# EAGLE design cpu (EAGLE 4.16)
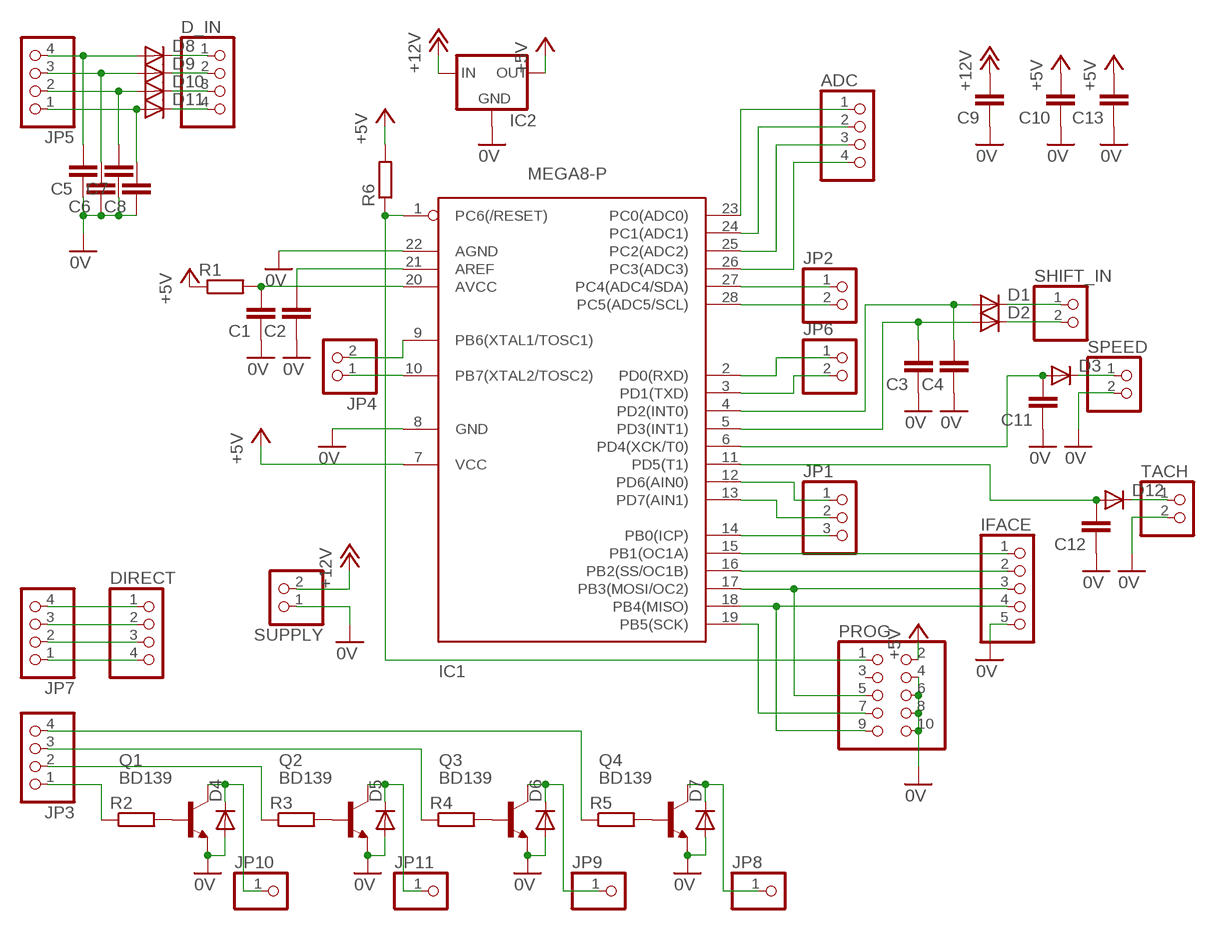
[diagram p0: schematic, sheet 1]

## Parts
ADC  PINHD-1X4  [1X04]
C1  C-EU050-025X075  [C050-025X075]
C2  C-EU050-025X075  [C050-025X075]
C3  C-EU050-025X075  [C050-025X075]
C4  C-EU050-025X075  [C050-025X075]
C5  C-EU050-025X075  [C050-025X075]
C6  C-EU050-025X075  [C050-025X075]
C7  C-EU050-025X075  [C050-025X075]
C8  C-EU050-025X075  [C050-025X075]
C9  C-EU050-025X075  [C050-025X075]
C10  C-EU050-025X075  [C050-025X075]
C11  C-EU050-025X075  [C050-025X075]
C12  C-EU050-025X075  [C050-025X075]
C13  C-EU050-025X075  [C050-025X075]
D1  DIODE-D-5  [D-5]
D2  DIODE-D-5  [D-5]
D3  DIODE-D-5  [D-5]
D4  DIODE-D-5  [D-5]
D5  DIODE-D-5  [D-5]
D6  DIODE-D-5  [D-5]
D7  DIODE-D-5  [D-5]
D8  DIODE-D-5  [D-5]
D9  DIODE-D-5  [D-5]
D10  DIODE-D-5  [D-5]
D11  DIODE-D-5  [D-5]
D12  DIODE-D-5  [D-5]
D_IN  PINHD-1X4  [1X04]
DIRECT  PINHD-1X4  [1X04]
IC1  MEGA8-P  [DIL28-3]
IC2  78XXL  [78XXL]
IFACE  PINHD-1X5  [1X05]
JP1  PINHD-1X3  [1X03]
JP2  PINHD-1X2  [1X02]
JP3  PINHD-1X4  [1X04]
JP4  PINHD-1X2  [1X02]
JP5  PINHD-1X4  [1X04]
JP6  PINHD-1X2  [1X02]
JP7  PINHD-1X4  [1X04]
JP8  PINHD-1X1  [1X01]
JP9  PINHD-1X1  [1X01]
JP10  PINHD-1X1  [1X01]
JP11  PINHD-1X1  [1X01]
PROG  PINHD-2X5  [2X05]
Q1  BD139  [TO126]
Q2  BD139  [TO126]
Q3  BD139  [TO126]
Q4  BD139  [TO126]
R1  R-EU_0207/7  [0207/7]
R2  R-EU_0207/7  [0207/7]
R3  R-EU_0207/7  [0207/7]
R4  R-EU_0207/7  [0207/7]
R5  R-EU_0207/7  [0207/7]
R6  R-EU_0207/7  [0207/7]
SHIFT_IN  PINHD-1X2  [1X02]
SPEED  PINHD-1X2  [1X02]
SUPPLY  PINHD-1X2  [1X02]
TACH  PINHD-1X2  [1X02]

## Nets
0V: C1.1 C2.1 C3.1 C4.1 C5.1 C6.1 C7.1 C8.1 C9.1 C10.1 C11.1 C12.1 C13.1 D4.A D5.A D6.A D7.A IC1.8(GND) IC1.22(AGND) IC2.GND IFACE.5 PROG.4 PROG.6 PROG.8 PROG.10 Q1.1(E) Q2.1(E) Q3.1(E) Q4.1(E) SPEED.2 SUPPLY.1 TACH.2
+5V: C10.2 C13.2 IC1.7(VCC) IC2.OUT PROG.2 R1.1 R6.2
+12V: C9.2 IC2.IN SUPPLY.2
N$1: D7.C JP8.1 Q4.2(C)
N$2: IC1.17(PB3(MOSI/OC2)) IFACE.3 PROG.5
N$3: IC1.18(PB4(MISO)) IFACE.4 PROG.9
N$4: IC1.19(PB5(SCK)) PROG.7
N$5: IC1.1(PC6(/RESET)) PROG.1 R6.1
N$6: C4.2 D1.A IC1.4(PD2(INT0))
N$7: C3.2 D2.A IC1.5(PD3(INT1))
N$8: C1.2 IC1.20(AVCC) R1.2
N$9: C2.2 IC1.21(AREF)
N$10: C12.2 D12.A IC1.11(PD5(T1))
N$11: C11.2 D3.A IC1.6(PD4(XCK/T0))
N$12: Q1.3(B) R2.2
N$13: Q2.3(B) R3.2
N$14: D4.C JP10.1 Q1.2(C)
N$15: D5.C JP11.1 Q2.2(C)
N$16: JP3.1 R2.1
N$17: Q3.3(B) R4.2
N$18: D6.C JP9.1 Q3.2(C)
N$19: JP3.2 R3.1
N$20: Q4.3(B) R5.2
N$21: JP3.3 R4.1
N$22: JP3.4 R5.1
N$23: D1.C SHIFT_IN.1
N$24: D2.C SHIFT_IN.2
N$25: ADC.1 IC1.23(PC0(ADC0))
N$26: ADC.2 IC1.24(PC1(ADC1))
N$27: ADC.3 IC1.25(PC2(ADC2))
N$28: ADC.4 IC1.26(PC3(ADC3))
N$29: IC1.27(PC4(ADC4/SDA)) JP2.1
N$30: IC1.28(PC5(ADC5/SCL)) JP2.2
N$31: IC1.13(PD7(AIN1)) JP1.2
N$32: IC1.12(PD6(AIN0)) JP1.1
N$33: IC1.15(PB1(OC1A)) IFACE.1
N$34: IC1.16(PB2(SS/OC1B)) IFACE.2
N$35: D8.C D_IN.1
N$36: D9.C D_IN.2
N$37: D10.C D_IN.3
N$38: D11.C D_IN.4
N$39: C5.2 D8.A JP5.4
N$40: C6.2 D9.A JP5.3
N$41: C7.2 D10.A JP5.2
N$42: C8.2 D11.A JP5.1
N$43: IC1.14(PB0(ICP)) JP1.3
N$44: IC1.2(PD0(RXD)) JP6.1
N$45: IC1.3(PD1(TXD)) JP6.2
N$46: IC1.10(PB7(XTAL2/TOSC2)) JP4.1
N$47: IC1.9(PB6(XTAL1/TOSC1)) JP4.2
N$48: DIRECT.4 JP7.1
N$49: DIRECT.3 JP7.2
N$50: DIRECT.2 JP7.3
N$51: DIRECT.1 JP7.4
N$52: D3.C SPEED.1
N$54: D12.C TACH.1
Unconnected: PROG.3

## Library data of the parts
ADC D_IN DIRECT JP3 JP5 JP7 = pinhead:PINHD-1X4: PIN HEADER
C1-C13 = rcl:C-EU: CAPACITOR, European symbol
D1-D12 = diode:DIODE-: DIODE
IC1 = atmel:MEGA8-P: MICROCONTROLLER 8 Kbytes FLASH 1 kbytes SRAM 512 bytes EEPROM USART 4-channel 10 bit ADC 2-channel 8 bit ADC Source: avr.lbr
IC2 = v-reg:78XXL: VOLTAGE REGULATOR
IFACE = pinhead:PINHD-1X5: PIN HEADER
JP1 = pinhead:PINHD-1X3: PIN HEADER
JP2 JP4 JP6 SHIFT_IN SPEED SUPPLY TACH = pinhead:PINHD-1X2: PIN HEADER
JP8-JP11 = pinhead:PINHD-1X1: PIN HEADER
PROG = pinhead:PINHD-2X5: PIN HEADER
Q1-Q4 = transistor-npn:BD139*: NPN Transistor
R1-R6 = rcl:R-EU_: RESISTOR, European symbol

## Board
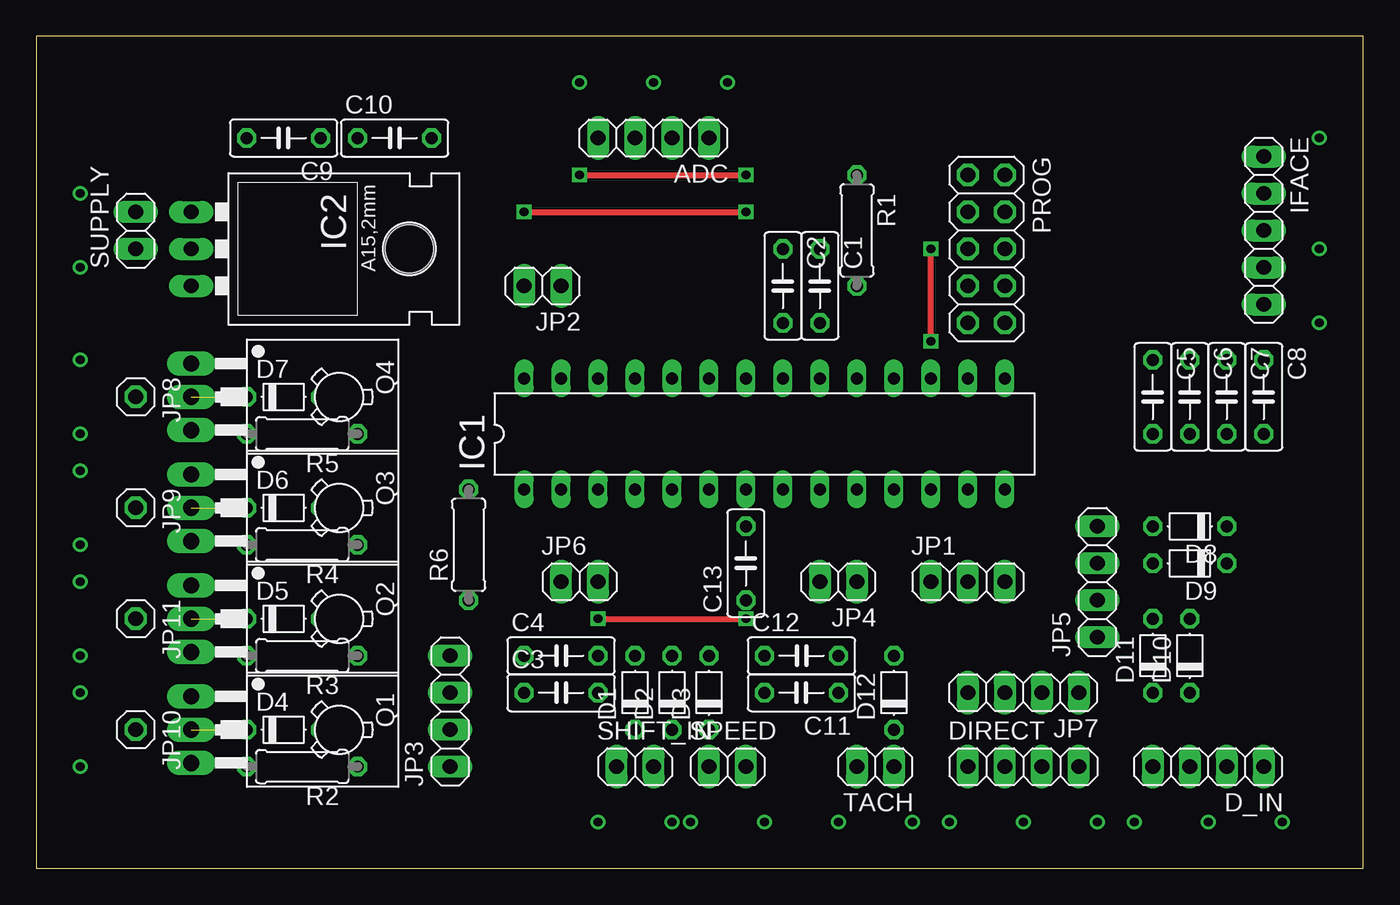
[diagram p1: board, top side]
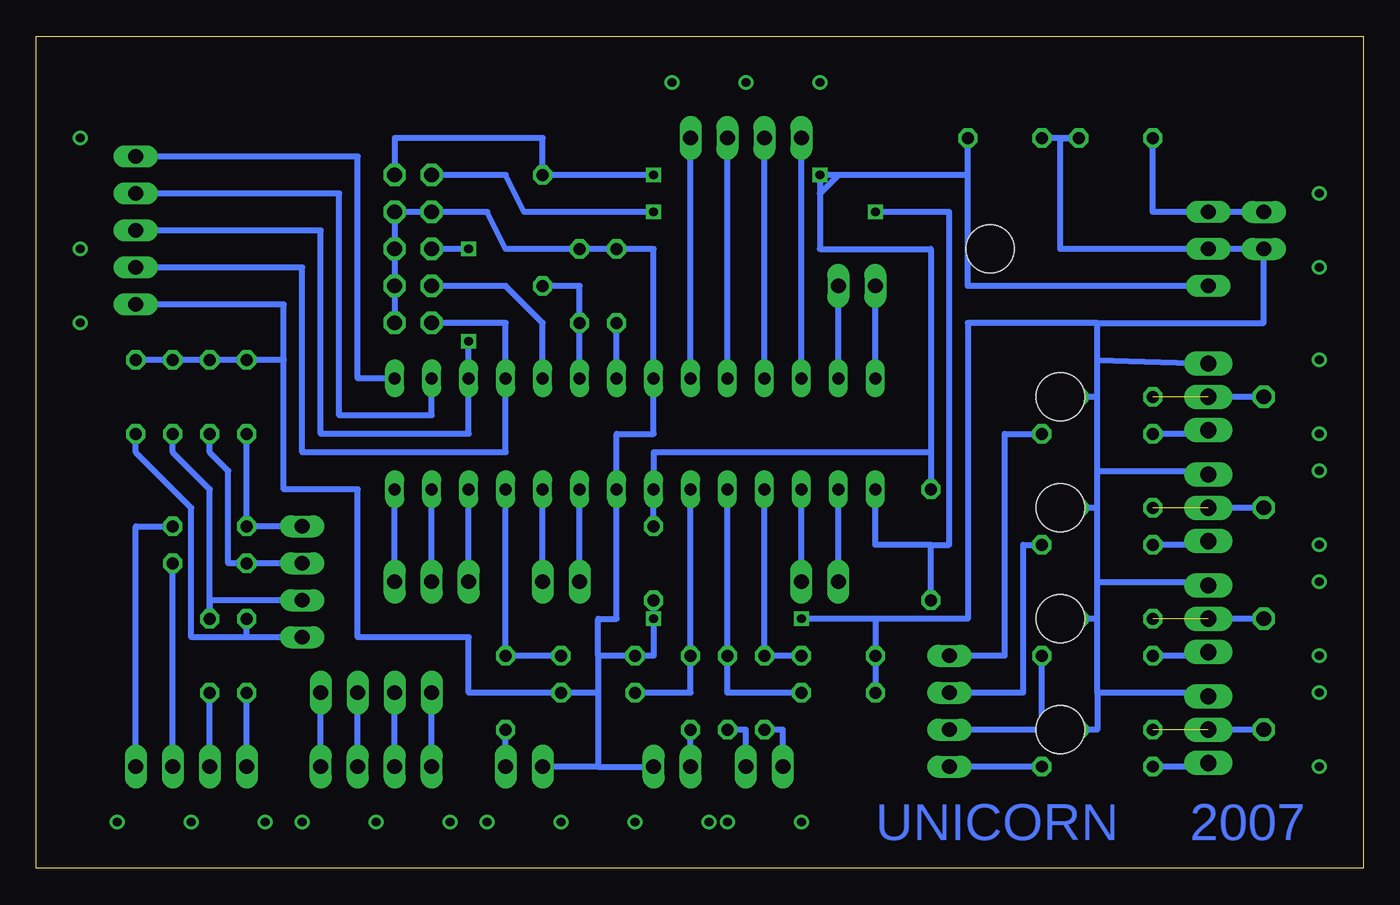
[diagram p2: board, bottom side, seen from below]

Size 91.11 x 57.14 mm. Coordinates in mm from the lower left corner, seen from the top.
Outline: 0,0 91.11,0 91.11,57.14 0,57.14 0,0
Copper layers (1*16): Top 0.035mm / dielectric 1.5mm / Bottom 0.035mm
Design rules "default": minimum track width 10mil, minimum drill 24mil, track to track 8mil, track to pad 8mil, pad to pad 8mil, via to via 8mil, smd to smd 8mil, copper to edge 40mil, drill to drill 8mil, minimum pad ring 10mil, minimum via ring 8mil, stop-mask expansion 4mil, vias tented up to drill 0mil, thermal gap 10mil

### Footprints (pad centres in the part's own frame; a part is rotated, then mirrored left to right if it is on the bottom)
1X04 = drill 1.016 long: 1 -3.81,0; 2 -1.27,0; 3 1.27,0; 4 3.81,0
C050-025X075 = drill 0.813 octagon: 1 -2.54,0; 2 2.54,0
D-5 = drill 0.813 octagon: A 2.54,0; C -2.54,0
DIL28-3 = drill 0.813 long: 1 -16.51,-3.81; 2 -13.97,-3.81; 3 -11.43,-3.81; 4 -8.89,-3.81; 5 -6.35,-3.81; 6 -3.81,-3.81; 7 -1.27,-3.81; 8 1.27,-3.81; 9 3.81,-3.81; 10 6.35,-3.81; 11 8.89,-3.81; 12 11.43,-3.81; 13 13.97,-3.81; 14 16.51,-3.81; 15 16.51,3.81; 16 13.97,3.81; 17 11.43,3.81; 18 8.89,3.81; 19 6.35,3.81; 20 3.81,3.81; 21 1.27,3.81; 22 -1.27,3.81; 23 -3.81,3.81; 24 -6.35,3.81; 25 -8.89,3.81; 26 -11.43,3.81; 27 -13.97,3.81; 28 -16.51,3.81
78XXL = drill 1.016 long: GND 0,-3.81; IN -2.54,-3.81; OUT 2.54,-3.81 | hole 3.302: 0,11.176
1X05 = drill 1.016 long: 1 -5.08,0; 2 -2.54,0; 3 0,0; 4 2.54,0; 5 5.08,0
1X03 = drill 1.016 long: 1 -2.54,0; 2 0,0; 3 2.54,0
1X02 = drill 1.016 long: 1 -1.27,0; 2 1.27,0
1X01 = drill 1.016 octagon: 1 0,0
2X05 = drill 1.016 octagon: 1 -5.08,-1.27; 2 -5.08,1.27; 3 -2.54,-1.27; 4 -2.54,1.27; 5 0,-1.27; 6 0,1.27; 7 2.54,-1.27; 8 2.54,1.27; 9 5.08,-1.27; 10 5.08,1.27
TO126 = drill 1.118 long: 1 -2.286,-5.08; 2 0,-5.08; 3 2.286,-5.08 | hole 3.302: 0,5.08
0207/7 = drill 0.813 octagon: 1 -3.81,0; 2 3.81,0

### Placement (x,y rotation side)
ADC  42.38,50.16 180 top
C1  53.81,40 270 top
C2  51.27,40 270 top
C3  36.03,12.06 0 top
C4  36.03,14.6 0 top
C5  76.67,32.38 270 top
C6  79.21,32.38 270 top
C7  81.75,32.38 270 top
C8  84.29,32.38 270 top
C9  16.98,50.16 180 top
C10  24.6,50.16 0 top
C11  52.54,12.06 180 top
C12  52.54,14.6 0 top
C13  48.73,20.95 90 top
D1  41.11,12.06 90 top
D2  43.65,12.06 90 top
D3  46.19,12.06 90 top
D4  16.98,9.52 0 top
D5  16.98,17.14 0 top
D6  16.98,24.76 0 top
D7  16.98,32.38 0 top
D8  79.21,23.49 180 top
D9  79.21,20.95 180 top
D10  79.21,14.6 90 top
D11  76.67,14.6 90 top
D12  58.89,12.06 90 top
D_IN  80.48,6.98 180 top
DIRECT  67.78,6.98 0 top
IC1  50,29.84 0 top
IC2  14.44,42.54 270 top
IFACE  84.29,43.81 270 top
JP1  63.97,19.68 0 top
JP2  34.76,40 180 top
JP3  28.41,10.79 90 top
JP4  55.08,19.68 180 top
JP5  72.86,19.68 90 top
JP6  37.3,19.68 0 top
JP7  67.78,12.06 180 top
JP8  6.82,32.38 270 top
JP9  6.82,24.76 270 top
JP10  6.82,9.52 270 top
JP11  6.82,17.14 270 top
PROG  65.24,42.54 270 top
Q1  15.71,9.52 270 top
Q2  15.71,17.14 270 top
Q3  15.71,24.76 270 top
Q4  15.71,32.38 270 top
R1  56.35,43.81 270 top
R2  18.25,6.98 180 top
R3  18.25,14.6 180 top
R4  18.25,22.22 180 top
R5  18.25,29.84 180 top
R6  29.68,22.22 90 top
SHIFT_IN  41.11,6.98 0 top
SPEED  47.46,6.98 0 top
SUPPLY  6.82,43.81 90 top
TACH  57.62,6.98 180 top

### Tracks (layer width: path | path; a pad name or v marks a point on that pad's centre or on a via)
0V  (via drill 0.6)
  Top 0.406: v38.57,17.14 v48.73,17.14
  Bottom 0.406: PROG.8 PROG.6 PROG.4 | PROG.8 PROG.10 | 52.54,12.06 52.54,6.98 | 52.54,14.6 52.54,12.06 | 52.54,14.6 52.54,17.14 51.27,17.14 IC1.8 51.27,29.84 48.73,29.84 IC1.22 48.73,42.54 C2.1 C1.1 58.89,42.54 60.16,45.08 PROG.4 | 52.54,6.98 SPEED.2 | 52.54,6.98 TACH.2 | 52.54,14.6 C12.1 48.73,14.6 v48.73,17.14 C13.1 | 52.54,12.06 C11.1 61.43,12.06 61.43,15.87 69.05,15.87 69.05,26.03 74.13,26.03 74.13,34.92 | 18.25,34.92 Q4.1 | 18.25,32.38 18.25,34.92 | 18.25,27.3 18.25,32.38 | Q3.1 10.63,27.3 18.25,27.3 | 18.25,24.76 18.25,27.3 | 18.25,19.68 18.25,24.76 | Q2.1 10.63,19.68 18.25,19.68 | Q1.1 10.63,12.06 18.25,12.06 | 18.25,17.14 18.25,19.68 | 18.25,12.06 18.25,17.14 | 18.25,32.38 D7.A | 18.25,24.76 D6.A | 18.25,17.14 D5.A | 18.25,12.06 18.25,9.52 D4.A | IFACE.5 74.13,38.73 74.13,34.92 | C3.1 C4.1 33.49,17.14 | SUPPLY.1 IC2.GND | SUPPLY.1 IC2.GND | SUPPLY.1 6.82,37.46 18.25,37.46 | 18.25,34.92 18.25,37.46 | IC2.GND 20.79,42.54 20.79,50.16 C9.1 C10.1 | 33.49,17.14 27.14,17.14 27.14,37.46 18.25,37.46 | C8.1 C7.1 C6.1 C5.1 74.13,34.92 | 33.49,17.14 v38.57,17.14 | PROG.4 PROG.8
+5V  (via drill 0.6)
  Top 0.406: v37.3,47.62 v48.73,47.62
  Bottom 0.406: 29.68,28.57 48.73,28.57 IC1.7 C13.2 | PROG.2 66.51,50.16 56.35,50.16 R1.1 v48.73,47.62 | 37.3,46.35 v37.3,47.62 36.03,47.62 | 37.3,46.35 37.3,42.54 29.68,42.54 29.68,28.57 | 29.68,28.57 R6.2 | IC2.OUT 27.14,40 27.14,47.62 | 27.14,47.62 36.03,47.62 | 27.14,47.62 C10.2 | 36.03,47.62 37.3,46.35
+12V
  Bottom 0.406: SUPPLY.2 IC2.IN 14.44,45.08 C9.2
N$1  (1 unrouted)
  Bottom 0.406: JP8.1 Q4.2
N$2  (via drill 0.6)
  Top 0.406: v61.43,36.19 v61.43,42.54
  Bottom 0.406: IFACE.3 71.59,43.81 71.59,29.84 61.43,29.84 IC1.17 v61.43,36.19 | v61.43,42.54 PROG.5
N$3
  Bottom 0.406: IFACE.4 72.86,41.27 72.86,28.57 58.89,28.57 IC1.18 58.89,37.46 PROG.9
N$4
  Bottom 0.406: IC1.19 56.35,37.46 58.89,40 PROG.7
N$5  (via drill 0.6)
  Top 0.406: v33.49,45.08 v48.73,45.08
  Bottom 0.406: PROG.1 58.89,47.62 57.62,45.08 v48.73,45.08 | v33.49,45.08 28.41,45.08 28.41,22.22 29.68,22.22 | R6.1 29.68,22.22 | 29.68,22.22 33.49,22.22 IC1.1
N$6
  Bottom 0.406: IC1.4 D1.A C4.2
N$7
  Bottom 0.406: IC1.5 D2.A 43.65,12.06 C3.2
N$8
  Bottom 0.406: IC1.20 C1.2 53.81,40 R1.2
N$9
  Bottom 0.406: IC1.21 C2.2
N$10
  Bottom 0.406: C12.2 D12.A IC1.11
N$11
  Bottom 0.406: IC1.6 D3.A 46.19,12.06 C11.2
N$12
  Bottom 0.406: Q1.3 10.63,6.98 R2.2
N$13
  Bottom 0.406: Q2.3 10.63,14.6 R3.2
N$14  (1 unrouted)
  Bottom 0.406: JP10.1 Q1.2
N$15  (1 unrouted)
  Bottom 0.406: JP11.1 Q2.2
N$16
  Bottom 0.406: R2.1 JP3.1
N$17
  Bottom 0.406: Q3.3 10.63,22.22 R4.2
N$18  (1 unrouted)
  Bottom 0.406: JP9.1 Q3.2
N$19
  Bottom 0.406: R3.1 22.06,9.52 JP3.2
N$20
  Bottom 0.406: Q4.3 10.63,29.84 R5.2
N$21
  Bottom 0.406: R4.1 23.33,22.22 23.33,12.06 JP3.3
N$22
  Bottom 0.406: R5.1 24.6,29.84 24.6,14.6 JP3.4
N$23
  Bottom 0.406: D1.C 39.84,9.52 SHIFT_IN.1
N$24
  Bottom 0.406: D2.C 42.38,9.52 SHIFT_IN.2
N$25
  Bottom 0.406: IC1.23 ADC.1
N$26
  Bottom 0.406: IC1.24 ADC.2
N$27
  Bottom 0.406: IC1.25 ADC.3
N$28
  Bottom 0.406: IC1.26 ADC.4
N$29
  Bottom 0.406: IC1.27 JP2.1
N$30
  Bottom 0.406: IC1.28 JP2.2
N$31
  Bottom 0.406: JP1.2 IC1.13
N$32
  Bottom 0.406: JP1.1 IC1.12
N$33
  Bottom 0.406: IC1.15 69.05,33.65 69.05,48.89 IFACE.1
N$34
  Bottom 0.406: IC1.16 63.97,31.11 70.32,31.11 70.32,46.35 IFACE.2
N$35
  Bottom 0.406: D8.C 84.29,23.49 D_IN.1
N$36
  Bottom 0.406: D_IN.2 D9.C
N$37
  Bottom 0.406: D_IN.3 D10.C
N$38
  Bottom 0.406: D_IN.4 D11.C
N$39
  Bottom 0.406: JP5.4 D8.A C5.2
N$40
  Bottom 0.406: JP5.3 D9.A 77.94,20.95 77.94,27.3 79.21,28.57 C6.2
N$41
  Bottom 0.406: JP5.2 79.21,18.41 D10.A 79.21,26.03 81.75,28.57 C7.2
N$42
  Bottom 0.406: JP5.1 76.67,15.87 | 76.67,15.87 D11.A | 76.67,15.87 80.48,15.87 80.48,24.76 84.29,28.57 C8.2
N$43
  Bottom 0.406: JP1.3 IC1.14
N$44
  Bottom 0.406: JP6.1 IC1.2
N$45
  Bottom 0.406: JP6.2 IC1.3
N$46
  Bottom 0.406: JP4.1 IC1.10
N$47
  Bottom 0.406: JP4.2 IC1.9
N$48
  Bottom 0.406: DIRECT.4 JP7.1
N$49
  Bottom 0.406: DIRECT.3 JP7.2
N$50
  Bottom 0.406: DIRECT.2 JP7.3
N$51
  Bottom 0.406: DIRECT.1 JP7.4
N$52
  Bottom 0.406: SPEED.1 D3.C
N$53  (via drill 0.6)
  other vias: 3.01,34.92
N$54
  Bottom 0.406: TACH.1 D12.C
N$55  (via drill 0.6)
  other vias: 3.01,29.84
N$56  (via drill 0.6)
  other vias: 3.01,27.3
N$57  (via drill 0.6)
  other vias: 3.01,22.22
N$58  (via drill 0.6)
  other vias: 3.01,19.68
N$59  (via drill 0.6)
  other vias: 3.01,14.6
N$60  (via drill 0.6)
  other vias: 3.01,12.06
N$61  (via drill 0.6)
  other vias: 3.01,6.98
N$62  (via drill 0.6)
  other vias: 37.3,53.97
N$63  (via drill 0.6)
  other vias: 42.38,53.97
N$64  (via drill 0.6)
  other vias: 47.46,53.97
N$65  (via drill 0.6)
  other vias: 43.65,3.17
N$66  (via drill 0.6)
  other vias: 38.57,3.17
N$67  (via drill 0.6)
  other vias: 50,3.17
N$68  (via drill 0.6)
  other vias: 44.92,3.17
N$69  (via drill 0.6)
  other vias: 62.7,3.17
N$70  (via drill 0.6)
  other vias: 72.86,3.17
N$71  (via drill 0.6)
  other vias: 67.78,3.17
N$72  (via drill 0.6)
  other vias: 80.48,3.17
N$73  (via drill 0.6)
  other vias: 75.4,3.17
N$74  (via drill 0.6)
  other vias: 85.56,3.17
N$75  (via drill 0.6)
  other vias: 3.01,46.35
N$76  (via drill 0.6)
  other vias: 3.01,41.27
N$77  (via drill 0.6)
  other vias: 55.08,3.17
N$78  (via drill 0.6)
  other vias: 60.16,3.17
N$79  (via drill 0.6)
  other vias: 88.1,42.54
N$80  (via drill 0.6)
  other vias: 88.1,37.46
N$81  (via drill 0.6)
  other vias: 88.1,50.16

### Text on the board
Bottom: 2007 | UNICORN